# EAGLE design parking v1 (EAGLE 9.7.0)
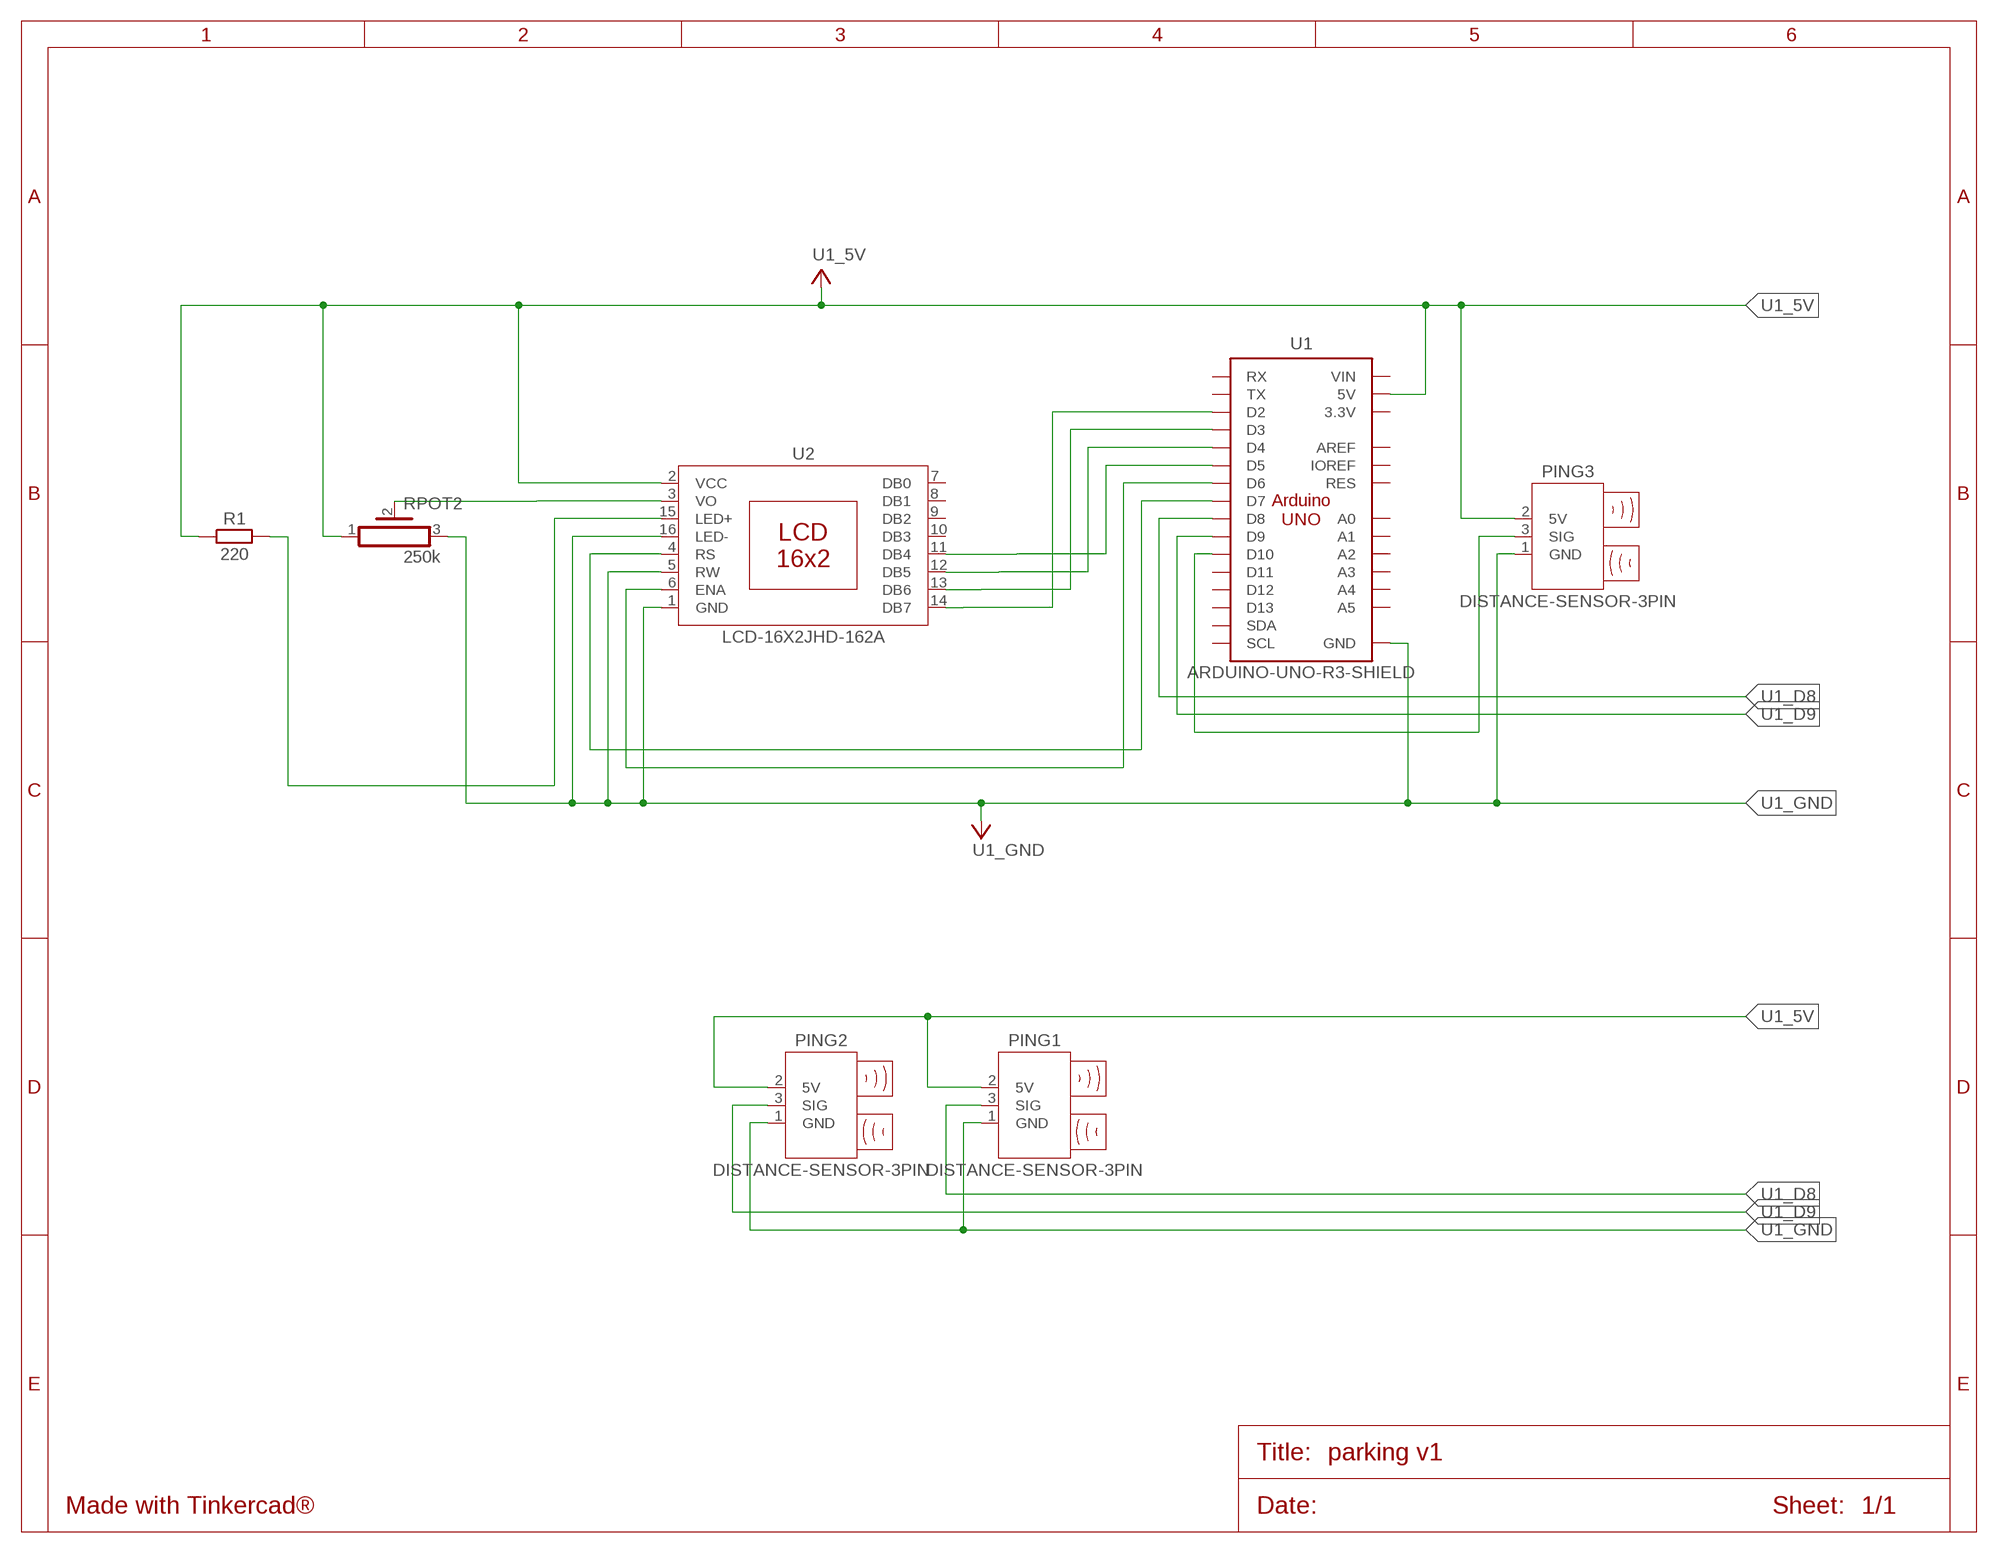
[diagram p0: schematic, sheet 1]

## Parts
PING1  DISTANCE-SENSOR-3PIN  [28015]
PING2  DISTANCE-SENSOR-3PIN  [28015]
PING3  DISTANCE-SENSOR-3PIN  [28015]
R1  220  RESISTOR_AXIAL-10.16MM-PITCH  [RESAD1016W63L850D250B]
RPOT2  250k  POT_HA-06  [HA-06-SM065]
U1  ARDUINO-UNO-R3-SHIELD  [ARDUINO-UNO-R3-SHIELD]
U2  LCD-16X2JHD-162A  [JHD-162A]

## Nets
U1_5V: PING1.2(5V) PING2.2(5V) PING3.2(5V) R1.1 RPOT2.1 U1.5V U2.2(VCC)
U1_D2: U1.D2 U2.14(DB7)
U1_D3: U1.D3 U2.13(DB6)
U1_D4: U1.D4 U2.12(DB5)
U1_D5: U1.D5 U2.11(DB4)
U1_D6: U1.D6 U2.6(ENA)
U1_D7: U1.D7 U2.4(RS)
U1_D8: PING1.3(SIG) U1.D8
U1_D9: PING2.3(SIG) U1.D9
U1_D10: PING3.3(SIG) U1.D10
U1_GND: PING1.1(GND) PING2.1(GND) PING3.1(GND) RPOT2.3 U1.GND@0(GND) U1.GND@1(GND) U1.GND@2(GND) U2.1(GND) U2.5(RW) U2.16(LED-)
U2_LED+: R1.2 U2.15(LED+)
U2_VO: RPOT2.2 U2.3(VO)
Unconnected: U1.3.3V U1.A0 U1.A1 U1.A2 U1.A3 U1.A4 U1.A5 U1.AREF U1.D11 U1.D12 U1.D13 U1.IOREF U1.RES U1.RX U1.SCL U1.SDA U1.TX U1.VIN U2.7(DB0) U2.8(DB1) U2.9(DB2) U2.10(DB3)

## Library data of the parts
PING1-PING3 = Tinkercad:DISTANCE-SENSOR-3PIN
R1 = Tinkercad:RESISTOR: Resistor Fixed - Generic
RPOT2 = Tinkercad:POT: Rectangular Trimmer Potentiometers - PV36 Series Datasheet <https://www.bourns.com/docs/Product-Datasheets/pv36.pdf>
U1 = Tinkercad:ARDUINO-UNO-R3-SHIELD
U2 = Tinkercad:LCD-16X2

## Board
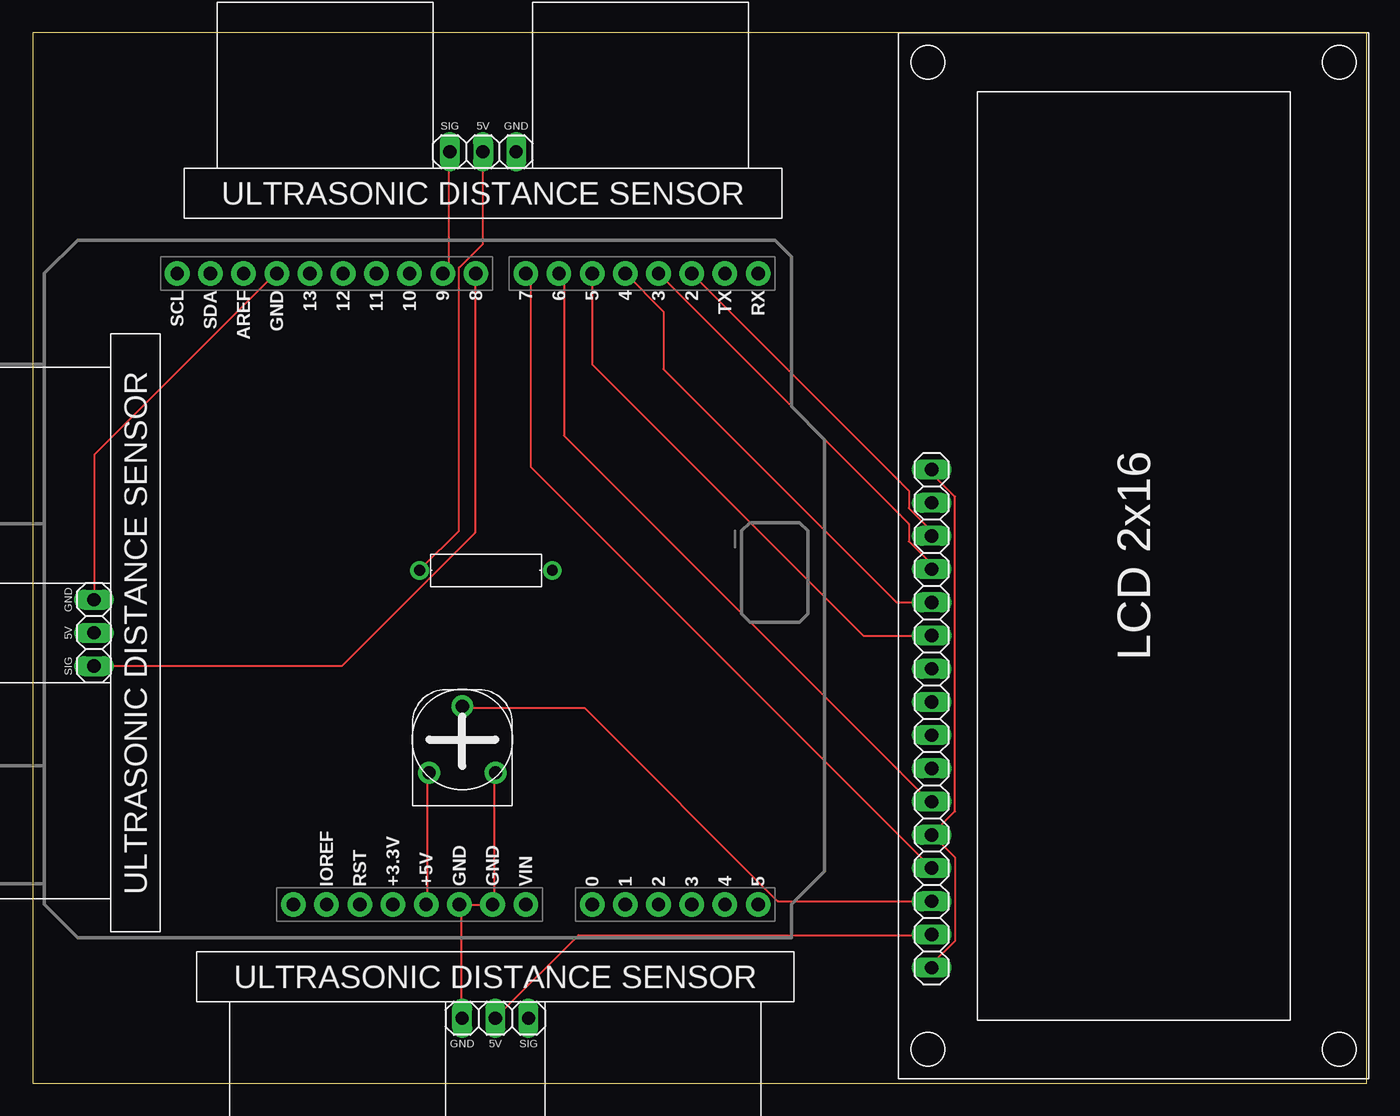
[diagram p1: board, top side]
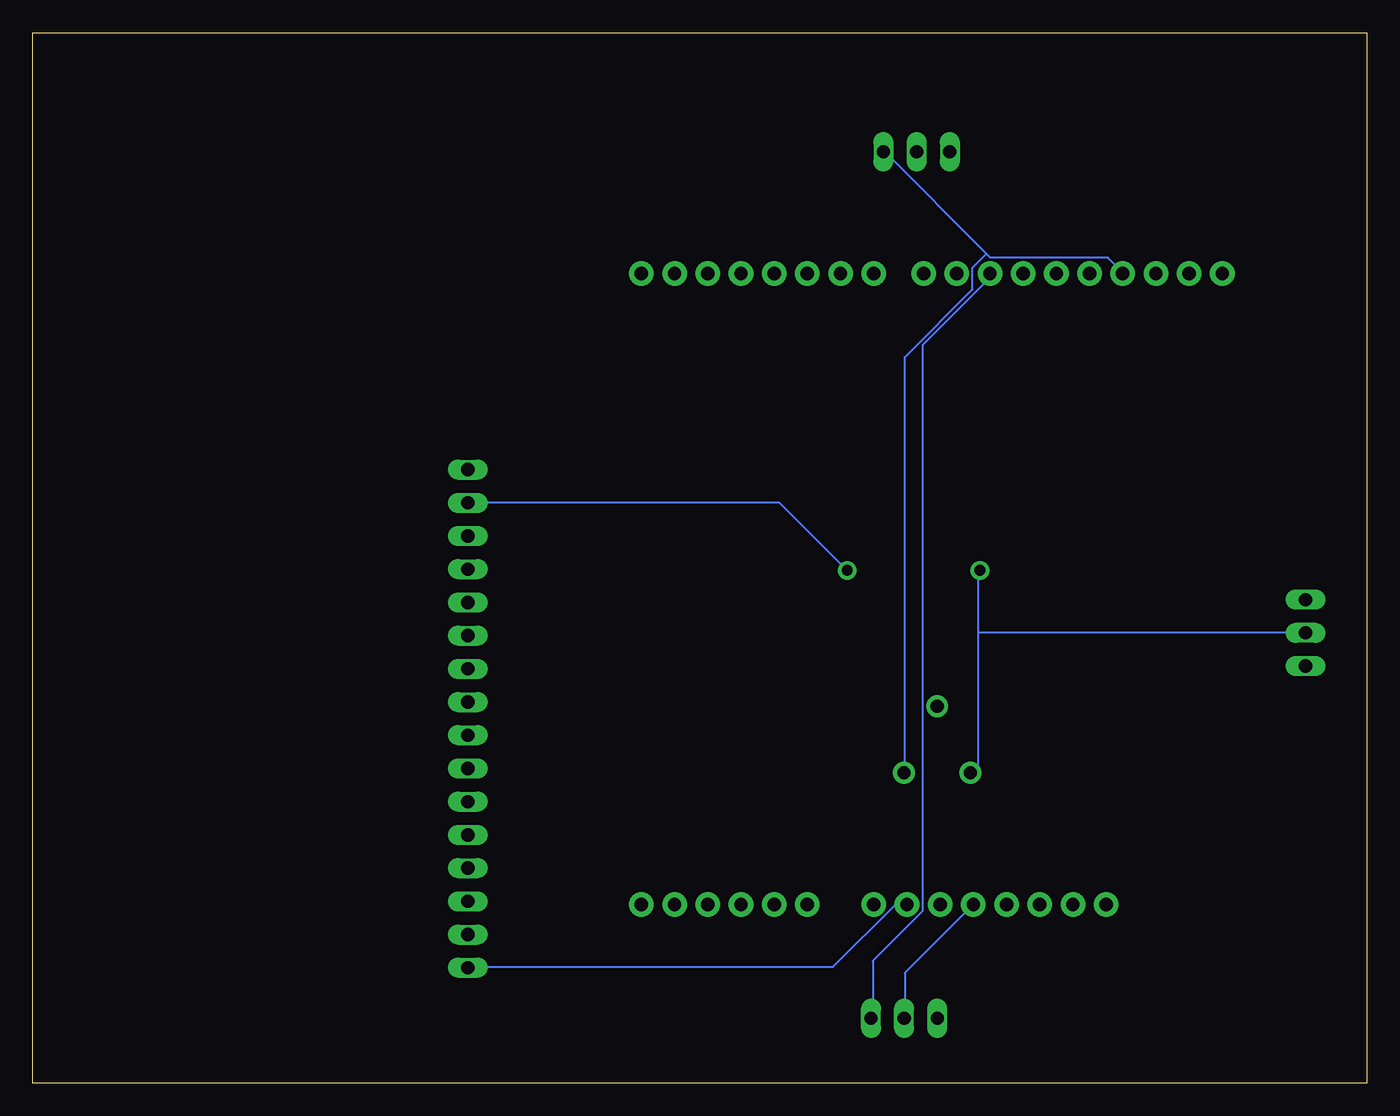
[diagram p2: board, bottom side, seen from below]

Size 102.07 x 80.34 mm. Coordinates in mm from the lower left corner, seen from the top.
Outline: 0,0 102.07,0 102.07,80.34 0,80.34 0,0
Copper layers (1*16): Top 0.035mm / dielectric 1.5mm / Bottom 0.035mm
Design rules "default": minimum track width 6mil, minimum drill 0.35mm, track to track 6mil, track to pad 6mil, pad to pad 6mil, via to via 6mil, smd to smd 6mil, copper to edge 40mil, drill to drill 6mil, minimum pad ring 10mil, minimum via ring 8mil, stop-mask expansion 4mil, vias tented up to drill 0mil, thermal gap 10mil

### Footprints (pad centres in the part's own frame; a part is rotated, then mirrored left to right if it is on the bottom)
28015 = drill 1.016 long: 1 -2.54,0; 2 0,0; 3 2.54,0
RESAD1016W63L850D250B = drill 0.83 pad 1.43: 1 -5.08,0; 2 5.08,0
HA-06-SM065 = drill 1 pad 1.676: 1 -2.54,-2.54; 2 0,2.54; 3 2.54,-2.54
ARDUINO-UNO-R3-SHIELD = drill 1.016 pad 1.88: 3.3V 24.13,-2.54; 5V 24.13,0; A0 24.13,12.7; A1 24.13,15.24; A2 24.13,17.78; A3 24.13,20.32; A4 24.13,22.86; A5 24.13,25.4; AREF -24.13,-13.97; D2 -24.13,20.32; D3 -24.13,17.78; D4 -24.13,15.24; D5 -24.13,12.7; D6 -24.13,10.16; D7 -24.13,7.62; D8 -24.13,3.81; D9 -24.13,1.27; D10 -24.13,-1.27; D11 -24.13,-3.81; D12 -24.13,-6.35; D13 -24.13,-8.89; GND@0 24.13,2.54; GND@1 24.13,5.08; GND@2 -24.13,-11.43; IOREF 24.13,-7.62; NC 24.13,-10.16; RES 24.13,-5.08; RX -24.13,25.4; SCL -24.13,-19.05; SDA -24.13,-16.51; TX -24.13,22.86; VIN 24.13,7.62
JHD-162A = drill 1.016 long: 1 -19.05,0; 2 -16.51,0; 3 -13.97,0; 4 -11.43,0; 5 -8.89,0; 6 -6.35,0; 7 -3.81,0; 8 -1.27,0; 9 1.27,0; 10 3.81,0; 11 6.35,0; 12 8.89,0; 13 11.43,0; 14 13.97,0; 15 16.51,0; 16 19.05,0

### Placement (x,y rotation side)
PING1  4.69,34.44 270 top
PING2  34.45,71.24 180 top
PING3  35.4,4.96 0 top
R1  34.68,39.22 0 top
RPOT2  32.87,26.28 0 top
U1  30.1,37.8 270 top
U2  68.78,27.88 90 top

### Tracks (layer width: path | path; a pad name or v marks a point on that pad's centre or on a via)
U1_5V
  Top 0.152: U2.2 68.73,11.33 41.76,11.33 35.51,5.08 PING3.2 | PING2.2 34.44,71.22 34.44,64.21 32.61,62.38 32.61,42.27 29.72,39.37 R1.1 | U1.5V 30.17,13.77 30.17,23.52 30.33,23.67 RPOT2.1
  Bottom 0.152: PING3.2 35.36,5.08 35.36,8.43 30.17,13.61 U1.5V | 29.72,34.49 29.72,24.43 30.33,23.82 RPOT2.1 | 29.72,34.49 29.72,39.22 R1.1 | 29.72,34.49 4.72,34.49 PING1.2
U1_D2
  Top 0.152: U1.D2 67.03,45.32 67.03,43.98 68.78,42.23 U2.14
  Bottom 0.152: 68.73,41.96 U2.14
U1_D3
  Top 0.152: U1.D3 67.03,42.78 67.03,41.44 68.78,39.69 U2.13
U1_D4
  Top 0.152: U1.D4 48.26,59.01 48.26,54.61 66.1,36.77 U2.12
U1_D5
  Top 0.152: U1.D5 42.8,54.98 63.56,34.23 U2.11
U1_D6
  Top 0.152: U1.D6 40.64,61.55 40.64,49.53 68.64,21.53 U2.6
U1_D7
  Top 0.152: U1.D7 38.1,61.55 38.1,47.13 U2.4
U1_D8
  Top 0.152: PING1.3 4.72,31.9 23.62,31.9 33.83,42.11 33.83,61.92 U1.D8
U1_D9
  Top 0.152: PING2.3 31.85,71.22 31.85,62.53 31.39,62.08 U1.D9
U1_D10
  Bottom 0.152: PING3.3 37.8,5.08 37.8,9.35 33.98,13.16 33.98,56.44 28.96,61.47 28.96,61.92 U1.D10
U1_GND
  Top 0.152: PING1.1 4.72,37.08 4.72,48.06 18.59,61.92 U1.GND@2 | 32.77,13.61 32.77,5.08 PING3.1 | RPOT2.3 35.36,23.67 35.36,13.92 35.2,13.77 U1.GND@1 35.05,13.61 32.77,13.61 | 32.77,13.61 U1.GND@0 | U2.1 68.89,8.89 68.89,9.2 70.56,10.87 70.56,17.27 68.89,18.95 U2.5 68.89,19.1 70.56,20.78 70.56,44.86 68.89,46.53 68.89,46.84 U2.16
  Bottom 0.152: 29.11,63.45 28.8,63.14 19.81,63.14 18.74,62.08 U1.GND@2 | 29.11,63.45 36.88,71.22 PING2.1 | U1.GND@1 35.2,13.61 36.12,13.61 40.84,8.89 68.73,8.89 U2.1 | 29.11,63.45 30.17,62.38 30.17,60.71 35.36,55.52 35.36,23.82 RPOT2.3
U2_LED+
  Bottom 0.152: R1.2 44.93,44.39 U2.15
U2_VO
  Top 0.152: U2.3 68.73,13.92 57,13.92 42.22,28.7 32.92,28.7 RPOT2.2